# EAGLE schematic tiny-uC-13 (EAGLE 5.07)
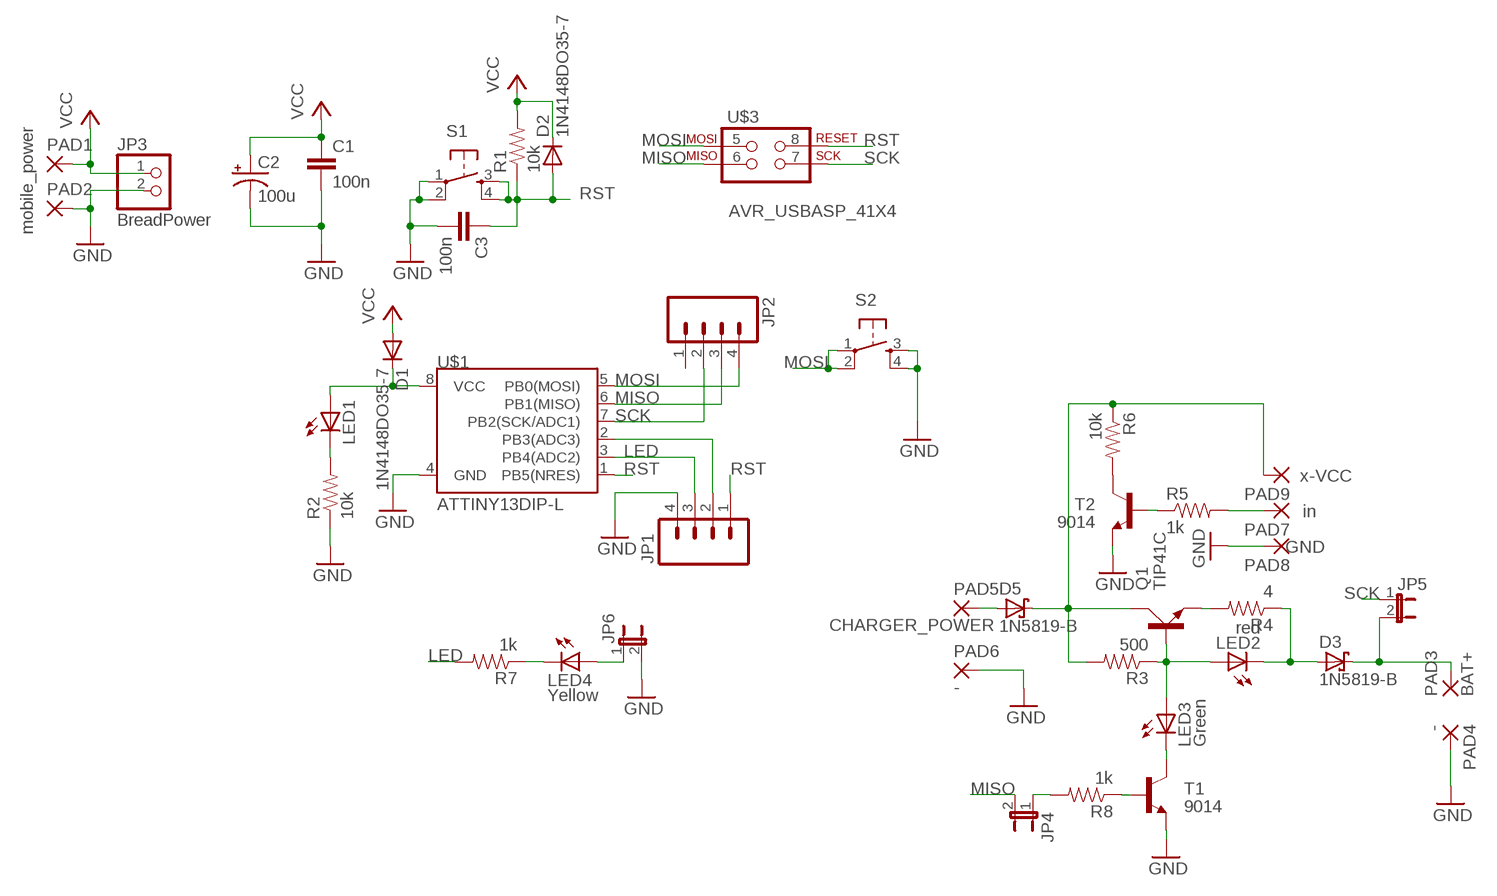
[diagram p0: schematic, sheet 1]

## Parts
C1  100n  CAP0805  [0805]
C2  100u  CAP_POLD  [PANASONIC_D]
C3  100n  CAP0805  [0805]
D1  1N4148DO35-7  [DO35-7]
D2  1N4148DO35-7  [DO35-7]
D3  1N5819-B  [DO41-7.6]
D5  1N5819-B  [DO41-7.6]
JP1  M04LOCK_LONGPADS  [1X04_LOCK_LONGPADS]
JP2  M04LOCK_LONGPADS  [1X04_LOCK_LONGPADS]
JP3  BreadPower  PINHD-1X2  [1X02]
JP4  JUMPER-2PTH  [1X02]
JP5  JUMPER-2PTH  [1X02]
JP6  JUMPER-2PTH  [1X02]
LED1  LEDCHIP-LED0805  [CHIP-LED0805]
LED2  red  LEDCHIP-LED0805  [CHIP-LED0805]
LED3  Green  LEDCHIP-LED0805  [CHIP-LED0805]
LED4  Yellow  LEDCHIP-LED0805  [CHIP-LED0805]
PAD1  mobile_power  2,54/0,8  [2,54/0,8]
PAD2  2,54/0,8  [2,54/0,8]
PAD3  BAT+  2,54/1,0  [2,54/1,0]
PAD4  -  2,54/1,0  [2,54/1,0]
PAD5  CHARGER_POWER  2,54/1,0  [2,54/1,0]
PAD6  -  2,54/1,0  [2,54/1,0]
PAD7  in  1,6/0,8  [1,6/0,8]
PAD8  GND  1,6/0,8  [1,6/0,8]
PAD9  x-VCC  1,6/0,8  [1,6/0,8]
Q1  TIP41C  [TO220AV]
R1  10k  RESISTOR1/4W  [AXIAL-0.3]
R2  10k  RESISTOR  [0805]
R3  500  RESISTOR  [0805]
R4  4  RESISTOR1/4W  [AXIAL-0.3]
R5  1k  RESISTOR  [0805]
R6  10k  RESISTOR  [0805]
R7  1k  RESISTOR  [0805]
R8  1k  RESISTOR  [0805]
S1  TAC_SWITCHPTH  [TACTILE-PTH]
S2  TAC_SWITCHPTH  [TACTILE-PTH]
T1  9014  TRANSISTOR_NPNSOT23  [SOT23]
T2  9014  TRANSISTOR_NPNSOT23  [SOT23]
U$1  ATTINY13DIP-L  [DIP08-L]
U$3  AVR_USBASP_41X4  [1X4]

## Nets
ADC: JP1.2 U$1.2(PB3(ADC3))
GND: C1.2 C2.- C3.2 JP1.4 JP3.2 JP6.2 PAD2.1(P) PAD4.1(P) PAD6.1(P) PAD8.1(P) R2.1 S1.1 S1.2 S2.3 S2.4 T1.2(E) T2.2(E) U$1.4(GND)
LED: JP1.3 R7.2 U$1.3(PB4(ADC2))
LI-CHARGE: D3.C JP5.2 PAD3.1(P)
MISO: JP2.3 JP4.2 U$1.6(PB1(MISO)) U$3.6
MOSI: JP2.4 S2.1 S2.2 U$1.5(PB0(MOSI)) U$3.5
N$2: R8.1 T1.1(B)
N$3: LED2.A LED3.A Q1.B R3.1
N$4: LED1.C R2.2
N$5: D1.C LED1.A U$1.8(VCC)
N$6: D3.A LED2.C R4.P$1
N$7: R6.2 T2.3(C)
N$8: Q1.E R4.P$2
N$9: JP4.1 R8.2
N$10: D5.C PAD9.1(P) Q1.C R3.2 R6.1
N$11: LED3.C T1.3(C)
N$12: R5.1 T2.1(B)
N$13: D5.A PAD5.1(P)
N$14: PAD7.1(P) R5.2
N$15: JP6.1 LED4.A
N$16: LED4.C R7.1
RST: C3.1 D2.A JP1.1 R1.P$1 S1.3 S1.4 U$1.1(PB5(NRES)) U$3.8
SCK: JP2.2 JP5.1 U$1.7(PB2(SCK/ADC1)) U$3.7
VCC: C1.1 C2.+ D1.A D2.C JP3.1 PAD1.1(P) R1.P$2
Unconnected: JP2.1

## Library data of the parts
C1 C3 = SparkFun:CAP: Capacitor Standard 0603 ceramic capacitor, and 0.1" leaded capacitor.
C2 = SparkFun:CAP_POL: Capacitor Polarized These are standard SMD and PTH capacitors. Normally 10uF, 47uF, and 100uF in electrolytic and tantalum varieties. Always verify the external diameter of the through hole cap, it varies with capacity, voltage, and manufacturer. The EIA devices should be standard.
D1 D2 = diode:1N4148: DIODE high speed (Philips)
D3 D5 = diode:1N581*: 1.0A SCHOTTKY BARRIER RECTIFIER Source: http://www.diodes.com/datasheets/ds23001.pdf
JP1 JP2 = SparkFun:M04: Header 4 Standard 4-pin 0.1" header. Use with straight break away headers (SKU : PRT-00116), right angle break away headers (PRT-00553), swiss pins (PRT-00743), machine pins (PRT-00117), and female headers (PRT-00115). Molex polarized connector foot print use with SKU : PRT-08231 with associated crimp pins and housings.
JP3 = pinhead:PINHD-1X2: PIN HEADER
JP4-JP6 = SparkFun:JUMPER-2: Jumper Basic 0.1" spaced jumper. Use with breakaway headers.
LED1-LED4 = led:LED: LED OSRAM: - CHIPLED LG R971, LG N971, LY N971, LG Q971, LY Q971, LO R971, LY R971 LH N974, LH R974 LS Q976, LO Q976, LY Q976 LO Q996 - Hyper CHIPLED LW Q18S LB Q993, LB Q99A, LB R99A - SideLED LS A670, LO A670, LY A670, LG A670, LP A670 LB A673, LV A673, LT A673, LW A673 LH A674 LY A675 LS A676, LA A676, LO A676, LY A676, LW A676 LS A679, LY A679, LG A679 - Hyper Micro SIDELED® LS Y876, LA Y876, LO Y876, LY Y876 LT Y87S - SmartLED LW L88C, LW L88S LB L89C, LB L89S, LG L890 LS L89K, LO L89K, LY L89K LS L896, LA L896, LO L896, LY L896 - TOPLED LS T670, LO T670, LY T670, LG T670, LP T670 LSG T670, LSP T670, LSY T670, LOP T670, LYG T670 LG T671, LOG T671, LSG T671 LB T673, LV T673, LT T673, LW T673 LH T674 LS T676, LA T676, LO T676, LY T676, LB T676, LH T676, LSB T676, LW T676 LB T67C, LV T67C, LT T67C, LS T67K, LO T67K, LY T67K, LW E67C LS E67B, LA E67B, LO E67B, LY E67B, LB E67C, LV E67C, LT E67C LW T67C LS T679, LY T679, LG T679 LS T770, LO T770, LY T770, LG T770, LP T770 LB T773, LV T773, LT T773, LW T773 LH T774 LS E675, LA E675, LY E675, LS T675 LS T776, LA T776, LO T776, LY T776, LB T776 LHGB T686 LT T68C, LB T68C - Hyper Mini TOPLED® LB M676 - Mini TOPLED Santana® LG M470 LS M47K, LO M47K, LY M47K Source: http://www.osram.convergy.de LUXEON: - LUMILED® LXK2-PW12-R00, LXK2-PW12-S00, LXK2-PW14-U00, LXK2-PW14-V00 LXK2-PM12-R00, LXK2-PM12-S00, LXK2-PM14-U00 LXK2-PE12-Q00, LXK2-PE12-R00, LXK2-PE12-S00, LXK2-PE14-T00, LXK2-PE14-U00 LXK2-PB12-K00, LXK2-PB12-L00, LXK2-PB12-M00, LXK2-PB14-N00, LXK2-PB14-P00, LXK2-PB14-Q00 LXK2-PR12-L00, LXK2-PR12-M00, LXK2-PR14-Q00, LXK2-PR14-R00 LXK2-PD12-Q00, LXK2-PD12-R00, LXK2-PD12-S00 LXK2-PH12-R00, LXK2-PH12-S00 LXK2-PL12-P00, LXK2-PL12-Q00, LXK2-PL12-R00 Source: www.luxeon.com KINGBRIGHT: KA-3528ASYC Source: www.kingbright.com
PAD1 PAD2 = wirepad:2,54/0,8: THROUGH-HOLE PAD
PAD3-PAD6 = wirepad:2,54/1,0: THROUGH-HOLE PAD
PAD7-PAD9 = wirepad:1,6/0,8: THROUGH-HOLE PAD
Q1 = transistor-power:TIP41C: NPN TRANSISTOR
R1-R8 = digital-toy:RESISTOR: Resistor Basic schematic elements and footprints for 0603, 1206, and PTH 1/10th watt (small) resistors.
S1 S2 = SparkFun:TAC_SWITCH: Momentary Switch Button commonly used for reset or general input. Spark Fun Electronics SKU : COM-00097
T1 T2 = SparkFun:TRANSISTOR_NPN: Transistor NPN BJT configuration in SOT23 package. MMBT2222 is the common NPN we use. Double check BCE configuration again layout.
U$1 = digital-toy:ATTINY13
U$3 = digital-toy:AVR_USBASP_4: AVR ISP 6 Pin This is the reduced ISP connector for AVR programming. Common on Arduino. This footprint will take up less PCB space and can be used with a 10-pin to 6-pin adapter such as SKU: BOB-08508